# EAGLE design Sensor_Board_2.04_HX711_DS18b2 (EAGLE 9.6.2)
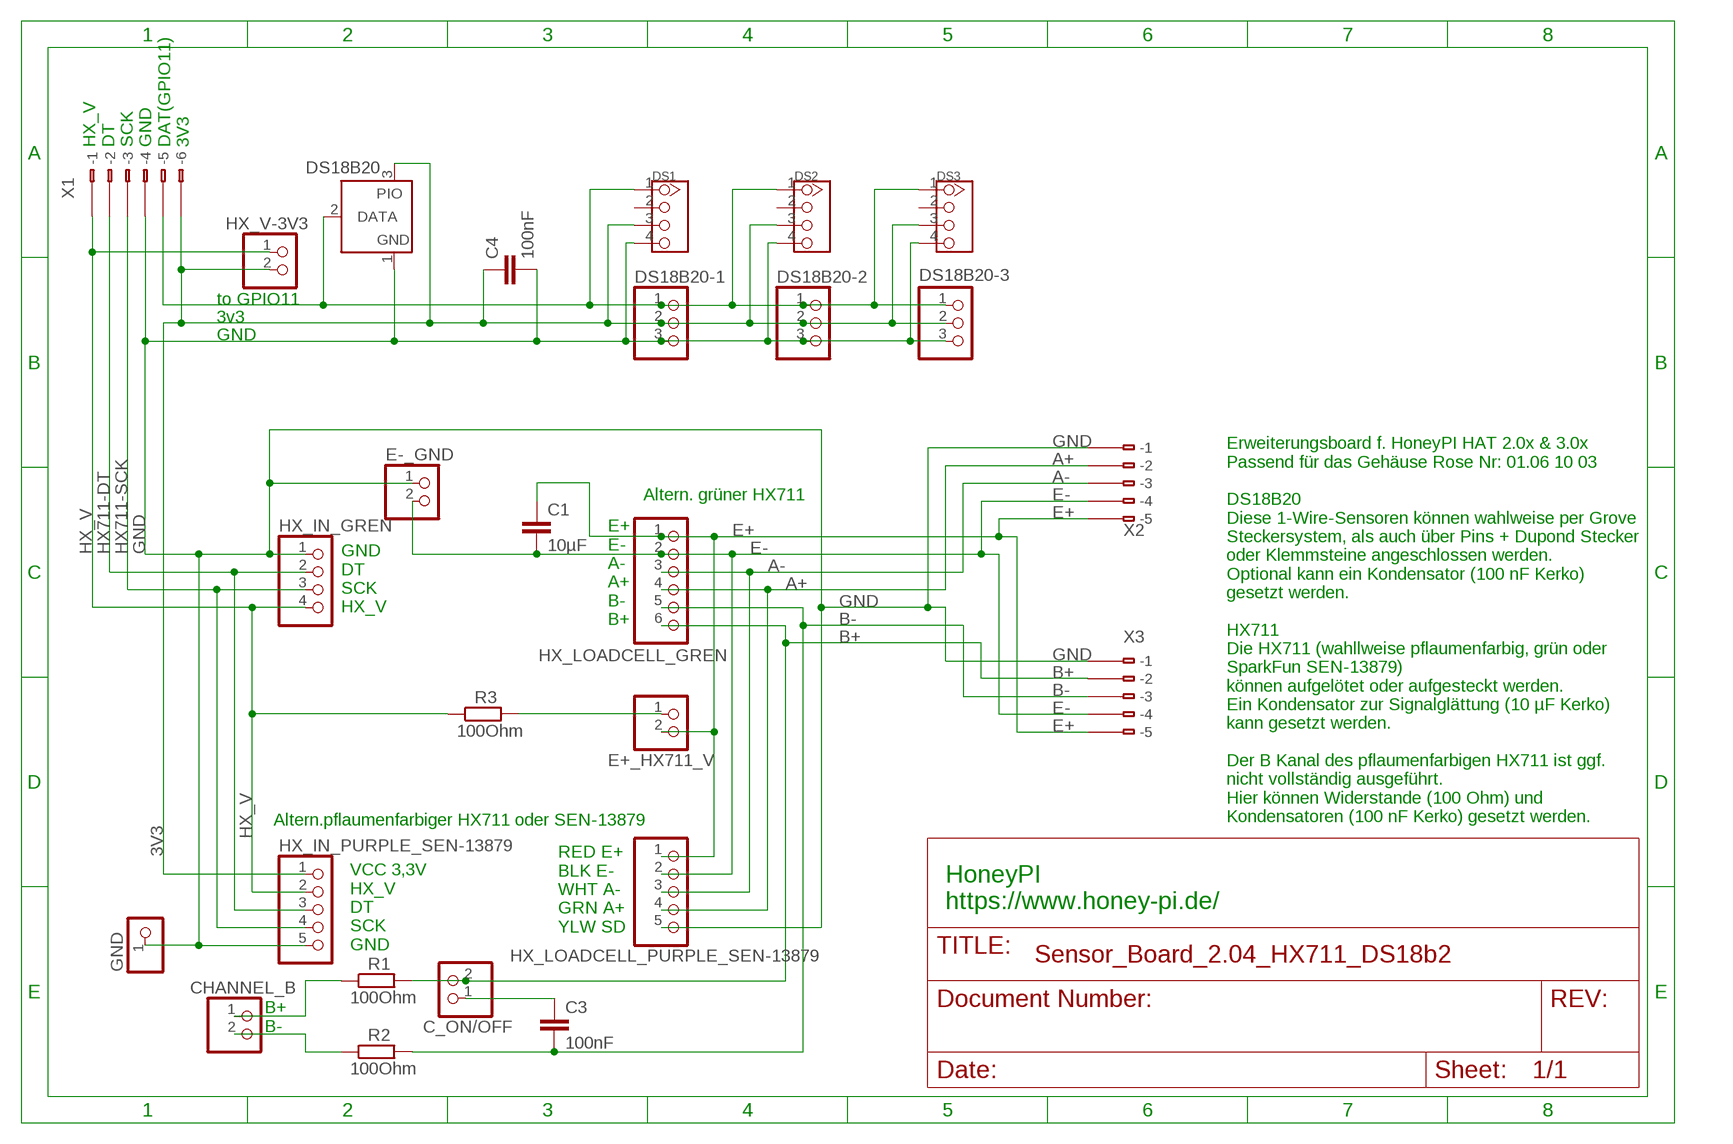
[diagram p0: schematic, sheet 1]

## Parts
C1  10µF  C5/2.5  [C5B2.5]
C3  100nF  C5/2.5  [C5B2.5]
C4  100nF  C5/2.5  [C5B2.5]
C_ON/OFF  PINHD-1X2  [1X02]
CHANNEL_B  PINHD-1X2  [1X02]
DS1  TWIG-4P-2.0-2.0  [4P-2.0]
DS2  TWIG-4P-2.0-2.0  [4P-2.0]
DS3  TWIG-4P-2.0-2.0  [4P-2.0]
DS18B20  DS2405  [TO92-]
DS18B20-1  PINHD-1X3  [1X03]
DS18B20-2  PINHD-1X3  [1X03]
DS18B20-3  PINHD-1X3  [1X03]
E+_HX711_V  PINHD-1X2  [1X02]
E-_GND  PINHD-1X2  [1X02]
GND  PINHD-1X1  [1X01]
HX_IN_GREN  PINHD-1X4  [1X04]
HX_IN_PURPLE_SEN-13879  PINHD-1X5  [1X05]
HX_LOADCELL_GREN  PINHD-1X6  [1X06]
HX_LOADCELL_PURPLE_SEN-13879  PINHD-1X5  [1X05]
HX_V-3V3  PINHD-1X2  [1X02]
R1  100Ohm  R-EU_0207/10  [0207/10]
R2  100Ohm  R-EU_0207/10  [0207/10]
R3  100Ohm  R-EU_0207/10  [0207/10]
X1  233-506  [233-506]
X2  233-505  [233-505]
X3  233-505  [233-505]

## Nets
3V3 [Supply3v3]: C4.1 DS1.3 DS2.3 DS3.3 DS18B20-1.2 DS18B20-2.2 DS18B20-3.2 DS18B20.3(PIO) HX_IN_PURPLE_SEN-13879.1 HX_V-3V3.2 X1.B6(B-6)
A+: HX_LOADCELL_GREN.4 HX_LOADCELL_PURPLE_SEN-13879.4 X2.B2(B-2)
A-: HX_LOADCELL_GREN.3 HX_LOADCELL_PURPLE_SEN-13879.3 X2.B3(B-3)
B+: C_ON/OFF.2 HX_LOADCELL_GREN.6 R1.2 X3.B2(B-2)
B-: C3.2 HX_LOADCELL_GREN.5 R2.2 X3.B3(B-3)
DS18B20_DATA_GPIO11_PIN23: DS1.1 DS2.1 DS3.1 DS18B20-1.1 DS18B20-2.1 DS18B20-3.1 DS18B20.2(DATA) X1.B5(B-5)
E+ [Supply5v]: C1.1 E+_HX711_V.2 HX_LOADCELL_GREN.1 HX_LOADCELL_PURPLE_SEN-13879.1 X2.B5(B-5) X3.B5(B-5)
E- [Supply5v]: C1.2 E-_GND.2 HX_LOADCELL_GREN.2 HX_LOADCELL_PURPLE_SEN-13879.2 X2.B4(B-4) X3.B4(B-4)
GND [Supply5v]: C4.2 DS1.4 DS2.4 DS3.4 DS18B20-1.3 DS18B20-2.3 DS18B20-3.3 DS18B20.1(GND) E-_GND.1 GND.1 HX_IN_GREN.1 HX_IN_PURPLE_SEN-13879.5 HX_LOADCELL_PURPLE_SEN-13879.5 X1.B4(B-4) X2.B1(B-1) X3.B1(B-1)
HX711-DT: HX_IN_GREN.2 HX_IN_PURPLE_SEN-13879.3 X1.B2(B-2)
HX711-SCK: HX_IN_GREN.3 HX_IN_PURPLE_SEN-13879.4 X1.B3(B-3)
HX_V [Supply5v]: HX_IN_GREN.4 HX_IN_PURPLE_SEN-13879.2 HX_V-3V3.1 R3.1 X1.B1(B-1)
N$1: CHANNEL_B.1 R1.1
N$2: CHANNEL_B.2 R2.1
N$3: C3.1 C_ON/OFF.1
N$4 [Supply5v]: E+_HX711_V.1 R3.2
Unconnected: DS1.2 DS2.2 DS3.2 X1.A1(-1) X1.A2(-2) X1.A3(-3) X1.A4(-4) X1.A5(-5) X1.A6(-6) X2.A1(-1) X2.A2(-2) X2.A3(-3) X2.A4(-4) X2.A5(-5) X3.A1(-1) X3.A2(-2) X3.A3(-3) X3.A4(-4) X3.A5(-5)

## Notes on the sheet
- HX_V
  DT
  SCK
  GND
  DAT(GPIO11)
  3V3
- to GPIO11
- 3v3
- GND
- Altern. grüner HX711
- GND
  DT
  SCK
  HX_V
- E+
  E-
  A-
  A+
  B-
  B+
- Erweiterungsboard f. HoneyPI HAT 2.0x & 3.0x
  Passend für das Gehäuse Rose Nr: 01.06 10 03 
  
  DS18B20
  Diese 1-Wire-Sensoren können wahlweise per Grove
  Steckersystem, als auch über Pins + Dupond Stecker
  oder Klemmsteine angeschlossen werden.
  Optional kann ein Kondensator (100 nF Kerko) 
  gesetzt werden. 
  
  HX711
  Die HX711 (wahllweise pflaumenfarbig, grün oder 
  SparkFun SEN-13879)
  können aufgelötet oder aufgesteckt werden.
  Ein Kondensator zur Signalglättung (10 µF Kerko)
  kann gesetzt werden.
  
  Der B Kanal des pflaumenfarbigen HX711 ist ggf. 
  nicht vollständig ausgeführt.
  Hier können Widerstande (100 Ohm) und
  Kondensatoren (100 nF Kerko) gesetzt werden.
- Altern.pflaumenfarbiger HX711 oder SEN-13879
- HoneyPI
  https://www.honey-pi.de/
- RED E+
  BLK E-
  WHT A-
  GRN A+
  YLW SD
- VCC 3,3V
  HX_V
  DT
  SCK
  GND
- B+
  B-

## Library data of the parts
C1 C3 C4 = capacitor-wima:C: CAPACITOR naming: grid - package width
C_ON/OFF CHANNEL_B E+_HX711_V E-_GND HX_V-3V3 = pinhead:PINHD-1X2: PIN HEADER
DS1-DS3 = Connector:TWIG-4P-2.0
DS18B20 = maxim:DS2405: Addressable Switch DALLAS Semiconductor; MF: DALLAS SEMICONDUCTOR; MPN: DS2405; OC_FARNELL: 1188025; OC_NEWARK: 06F4645
DS18B20-1-DS18B20-3 = pinhead:PINHD-1X3: PIN HEADER
GND = pinhead:PINHD-1X1: PIN HEADER
HX_IN_GREN = pinhead:PINHD-1X4: PIN HEADER
HX_IN_PURPLE_SEN-13879 HX_LOADCELL_PURPLE_SEN-13879 = pinhead:PINHD-1X5: PIN HEADER
HX_LOADCELL_GREN = pinhead:PINHD-1X6: PIN HEADER
R1-R3 = rcl:R-EU_: RESISTOR, European symbol; SPICEPREFIX: R
X1 = con-wago:233-506: WAGO Cage Clamp; MF: Wago Corporation; MPN: 0233-0506; OC_FARNELL: 1777100; OC_NEWARK: 79K2052
X2 X3 = con-wago:233-505: WAGO Cage Clamp; MF: Wago Corporation; MPN: 0233-0505; OC_FARNELL: unknown; OC_NEWARK: 79K2051

## Net classes
0 Signal: width 0.152 mm, clearance 0.305 mm
1 Supply3v3: width 0.203 mm, clearance 0.305 mm
2 Supply5v: width 0.406 mm, clearance 0.305 mm

## Board
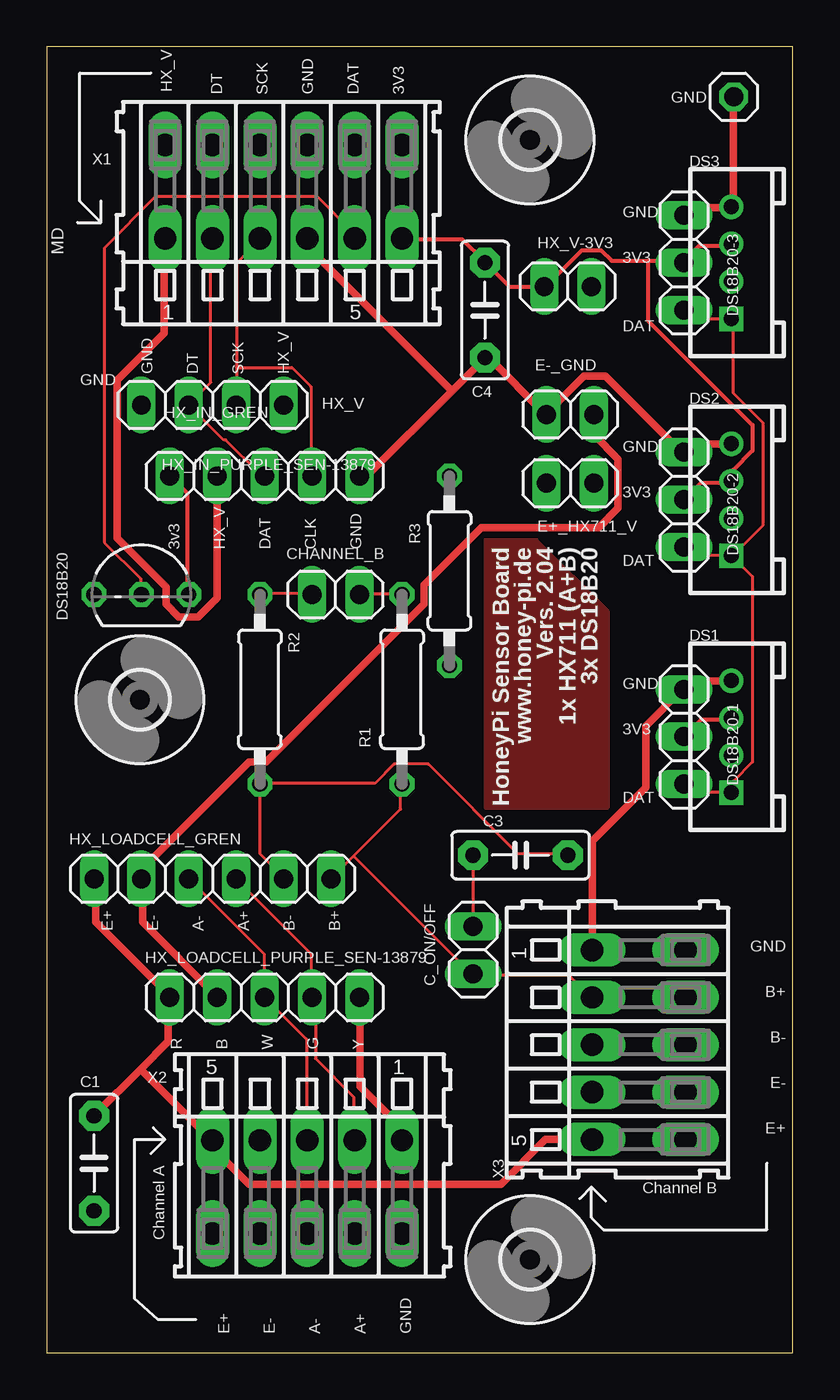
[diagram p1: board, top side]
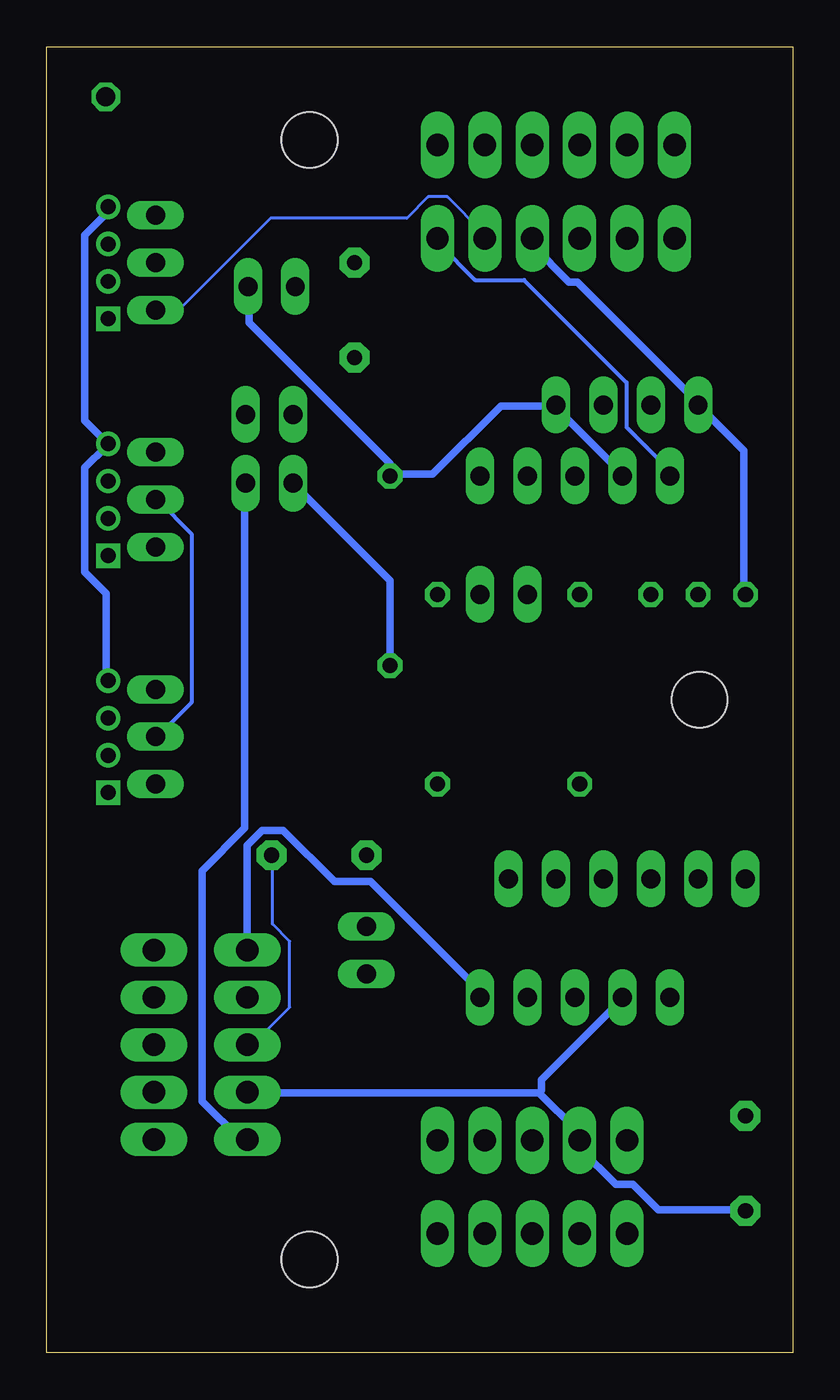
[diagram p2: board, bottom side, seen from below]

Size 40 x 70 mm. Coordinates in mm from the lower left corner, seen from the top.
Outline: 0,0 40,0 40,70 0,70 0,0
Copper layers (1*16): Top 0.035mm / dielectric 1.5mm / Bottom 0.035mm
Design rules "default *": minimum track width 6mil, minimum drill 0.35mm, track to track 6mil, track to pad 6mil, pad to pad 6mil, via to via 6mil, smd to smd 6mil, copper to edge 40mil, drill to drill 1mm, minimum pad ring 10mil, minimum via ring 8mil, stop-mask expansion 4mil, vias tented up to drill 0mil, thermal gap 10mil

### Footprints (pad centres in the part's own frame; a part is rotated, then mirrored left to right if it is on the bottom)
C5B2.5 = drill 0.813 pad 1.6 octagon: 1 -2.54,0; 2 2.54,0
1X02 = drill 1.016 long: 1 -1.27,0; 2 1.27,0
4P-2.0 = drill 0.8 pad 1.27 square: 1 -3,0 | drill 0.8 pad 1.27: 2 -1,0; 3 1,0; 4 3,0
TO92- = drill 0.813 octagon: 1 -2.54,0; 2 0,0; 3 2.54,0
1X03 = drill 1.016 long: 1 -2.54,0; 2 0,0; 3 2.54,0
1X01 = drill 1.016 octagon: 1 0,0
1X04 = drill 1.016 long: 1 -3.81,0; 2 -1.27,0; 3 1.27,0; 4 3.81,0
1X05 = drill 1.016 long: 1 -5.08,0; 2 -2.54,0; 3 0,0; 4 2.54,0; 5 5.08,0
1X06 = drill 1.016 long: 1 -6.35,0; 2 -3.81,0; 3 -1.27,0; 4 1.27,0; 5 3.81,0; 6 6.35,0
0207/10 = drill 0.813 octagon: 1 -5.08,0; 2 5.08,0
3,0 = hole 3: 0,0
233-506 = drill 1.2 long: A1 -6.35,2.5; A2 -3.81,2.5; A3 -1.27,2.5; A4 1.27,2.5; A5 3.81,2.5; A6 6.35,2.5; B1 -6.35,-2.5; B2 -3.81,-2.5; B3 -1.27,-2.5; B4 1.27,-2.5; B5 3.81,-2.5; B6 6.35,-2.5
233-505 = drill 1.2 long: A1 -5.08,2.5; A2 -2.54,2.5; A3 0,2.5; A4 2.54,2.5; A5 5.08,2.5; B1 -5.08,-2.5; B2 -2.54,-2.5; B3 0,-2.5; B4 2.54,-2.5; B5 5.08,-2.5

### Placement (x,y rotation side)
C1  2.54,10.16 270 top
C3  25.4,26.67 0 top
C4  23.5,55.88 270 top
C_ON/OFF  22.86,21.59 270 top
CHANNEL_B  15.49,40.64 180 top
DS1  36.7,33.02 90 top
DS2  36.7,45.72 90 top
DS3  36.7,58.42 90 top
DS18B20  5.08,40.64 0 top
DS18B20-1  34.16,33.02 90 top
DS18B20-2  34.16,45.72 90 top
DS18B20-3  34.16,58.42 90 top
E+_HX711_V  28.07,46.61 0 top
E-_GND  28.07,50.29 0 top
GND  36.83,67.31 0 top
HX_IN_GREN  8.89,50.8 0 top
HX_IN_PURPLE_SEN-13879  11.68,46.99 0 top
HX_LOADCELL_GREN  8.89,25.4 0 top
HX_LOADCELL_PURPLE_SEN-13879  11.68,19.05 0 top
HX_V-3V3  27.94,57.15 180 top
R1  19.05,35.56 270 top
R2  11.43,35.56 270 top
R3  21.59,41.91 270 top
U$1  [3,0]  25.91,5 0 top
U$2  [3,0]  25.91,65 0 top
U$5  [3,0]  5,35 0 top
X1  12.7,62.23 0 top
X2  13.97,8.89 180 top
X3  31.75,16.51 270 top

### Tracks (layer width: path | path; a pad name or v marks a point on that pad's centre or on a via)
3V3
  Top 0.203: DS18B20-1.2 35.09,33.95 36.69,33.95 DS1.3 | DS18B20-2.2 34.18,45.72 35.09,46.63 36.69,46.63 DS2.3 36.8,46.75 36.8,47.32 37.83,48.35 37.83,49.72 32.23,55.32 32.23,58.52 | DS18B20.3 7.54,40.69 7.54,46.06 6.63,46.98 HX_IN_PURPLE_SEN-13879.1 | DS3.3 36.69,59.32 34.98,59.32 34.18,58.52 DS18B20-3.2 34.06,58.52 32.23,58.52 | X1.B6 19.09,59.66 22.29,59.66 23.43,58.52 C4.1 23.55,58.41 24.8,57.15 HX_V-3V3.2 26.75,57.15 28.69,59.09 29.72,59.09 30.29,58.52 32.23,58.52
  Bottom 0.203: DS18B20-1.2 34.06,33.03 32.23,34.86 32.23,43.89 34.06,45.72 DS18B20-2.2 | HX_IN_PURPLE_SEN-13879.1 6.63,47.09 6.63,47.32 8.91,49.61 8.91,52.01 14.4,57.49 17.03,57.49 18.97,59.44 18.97,59.66 X1.B6
A+
  Top 0.152: HX_LOADCELL_GREN.4 10.17,25.38 14.17,21.37 14.17,19.09 HX_LOADCELL_PURPLE_SEN-13879.4 14.29,18.97 14.4,18.86 14.4,15.77 16.46,13.72 16.46,11.43 X2.B2
A-
  Top 0.152: HX_LOADCELL_GREN.3 7.66,25.38 11.66,21.37 11.66,19.09 HX_LOADCELL_PURPLE_SEN-13879.3 11.77,18.97 13.95,16.8 13.95,11.43 X2.B3
B+
  Top 0.152: 16.46,26.63 15.32,25.49 HX_LOADCELL_GREN.6 | 16.46,26.63 18.97,29.15 18.97,30.4 R1.2 | 22.86,20.23 28,20.23 29.15,19.09 X3.B2 | 22.86,20.23 16.46,26.63 | 22.86,20.23 C_ON/OFF.2
B-
  Top 0.152: HX_LOADCELL_GREN.5 12.69,25.49 11.43,26.75 R2.2 11.43,30.52 17.6,30.52 18.63,31.55 20.46,31.55 25.26,26.75 27.89,26.75 C3.2
  Bottom 0.152: C3.2 27.89,26.63 27.89,22.97 26.98,22.06 26.98,18.52 28.92,16.57 29.15,16.57 X3.B3
DS18B20_DATA_GPIO11_PIN23
  Top 0.152: DS18B20-3.1 34.18,55.78 34.52,55.44 36.69,55.44 DS3.1 36.8,55.32 36.8,51.44 38.41,49.84 38.41,44.35 36.8,42.75 DS2.1 | DS18B20-1.1 34.18,30.4 34.52,30.06 36.69,30.06 DS1.1 36.8,30.06 36.8,30.63 37.83,31.66 37.83,41.6 36.8,42.63 DS2.1 | DS2.1 36.69,42.75 34.52,42.75 34.18,43.09 DS18B20-2.1 | DS18B20.2 5.03,40.69 5.03,41.49 3.09,43.43 3.09,59.21 5.83,61.95 14.52,61.95 16.46,60.01 16.46,59.78 X1.B5
  Bottom 0.152: DS18B20-3.1 34.06,55.89 32.92,55.89 28,60.81 20.69,60.81 19.55,61.95 18.52,61.95 16.57,60.01 16.57,59.78 X1.B5
E+
  Top 0.406: 5.03,15.2 2.63,12.8 C1.1 | 5.03,15.2 6.51,16.69 6.51,18.97 HX_LOADCELL_PURPLE_SEN-13879.1 6.51,19.2 2.63,23.09 2.63,25.38 HX_LOADCELL_GREN.1 | 5.03,15.2 8.8,11.43 X2.B5 8.91,11.2 8.91,10.97 10.86,9.03 24.35,9.03 26.75,11.43 X3.B5
  Bottom 0.406: X3.B5 29.6,11.43 31.66,13.49 31.66,25.83 29.38,28.12 29.38,46.52 E+_HX711_V.2
E-
  Top 0.406: HX_LOADCELL_PURPLE_SEN-13879.2 9.14,19.09 5.14,23.09 5.14,25.38 HX_LOADCELL_GREN.2 5.26,25.49 5.26,26.06 10.86,31.66 11.77,31.66 20.23,40.12 20.23,41.15 23.32,44.23 29.6,44.23 30.63,45.26 30.63,47.89 29.38,49.15 29.38,50.29 E-_GND.2
  Bottom 0.406: C1.2 2.63,7.66 7.2,7.66 8.57,9.03 9.49,9.03 11.43,10.97 X2.B4 11.54,11.54 11.54,11.89 13.6,13.95 | 13.6,13.95 29.15,13.95 X3.B4 | 13.6,13.95 13.49,14.06 13.49,14.63 9.14,18.97 HX_LOADCELL_PURPLE_SEN-13879.2
GND
  Top 0.406: HX_LOADCELL_PURPLE_SEN-13879.5 16.8,18.97 16.8,14.29 18.97,12.12 18.97,11.43 X2.B1 | DS1.4 36.69,36.01 34.52,36.01 34.18,35.66 DS18B20-1.3 34.06,35.55 32.12,33.6 32.12,30.29 29.26,27.43 29.26,21.6 X3.B1 | DS18B20-3.3 34.18,61.04 34.52,61.38 36.69,61.38 DS3.4 36.8,61.49 36.8,67.21 GND.1 | DS2.4 36.69,48.69 34.52,48.69 34.18,48.35 DS18B20-2.3 34.06,48.46 33.83,48.46 29.95,52.35 28.8,52.35 26.86,50.41 E-_GND.1 26.75,50.29 23.66,53.38 C4.2 23.43,53.26 21.72,51.55 | 21.72,51.55 17.26,47.09 16.8,47.09 HX_IN_PURPLE_SEN-13879.5 | 21.72,51.55 14.06,59.21 14.06,59.66 X1.B4
  Bottom 0.406: HX_LOADCELL_PURPLE_SEN-13879.5 16.8,19.09 16.8,19.43 22.63,25.26 24.57,25.26 27.32,28 28.46,28 29.26,27.2 29.26,21.6 X3.B1 | DS18B20.1 2.63,40.69 2.63,48.35 HX_IN_GREN.1 5.14,50.98 11.54,57.38 12,57.38 13.95,59.32 13.95,59.66 X1.B4 | DS3.4 36.8,61.38 36.8,61.04 37.95,59.89 37.95,49.95 36.8,48.81 DS2.4 36.8,48.58 37.95,47.43 37.95,41.83 36.8,40.69 36.8,36.12 DS1.4
HX711-DT
  Top 0.152: HX_IN_PURPLE_SEN-13879.3 11.66,47.09 11.43,47.09 9.6,48.92 9.49,48.92 7.66,50.75 HX_IN_GREN.2 7.66,50.86 8.8,52.01 8.8,59.66 X1.B2
HX711-SCK
  Top 0.152: 10.17,52.81 10.17,58.41 11.43,59.66 X1.B3 | 10.17,52.81 10.17,50.86 HX_IN_GREN.3 | 10.17,52.81 13.14,52.81 14.17,51.78 14.17,47.09 HX_IN_PURPLE_SEN-13879.4
HX_V
  Top 0.406: HX_IN_PURPLE_SEN-13879.2 9.14,40.46 8.12,39.43 7.09,39.43 6.4,40.12 6.4,41.03 3.77,43.66 3.77,52.12 6.29,54.63 6.29,59.66 X1.B1
  Bottom 0.406: HX_IN_PURPLE_SEN-13879.2 9.14,47.09 12.69,50.63 HX_IN_GREN.4 12.8,50.75 15.66,50.75 19.32,47.09 21.49,47.09 R3.1 21.6,47.21 21.6,47.66 29.15,55.21 29.15,57.15 HX_V-3V3.1
N$1
  Top 0.152: R1.1 18.97,40.69 16.8,40.69 CHANNEL_B.1
N$2
  Top 0.152: R2.1 11.43,40.69 14.17,40.69 CHANNEL_B.2
N$3
  Top 0.152: C3.1 C_ON/OFF.1
N$4
  Bottom 0.406: R3.2 21.6,36.92 21.6,41.38 26.75,46.52 E+_HX711_V.1
N$5
  pour Top: 23.5,43.56 23.5,29.21 30.1,29.21 30.1,39.75 26.29,43.56

### Text on the board
tNames: HX_V | DT / / SCK / / GND / / DAT / / 3V3 | MD | GND / / 3V3 / / / DAT | GND / / DT / / SCK / / HX_V | GND | HX_V | 3v3 / / HX_V / / DAT / / CLK / / GND | HoneyPi Sensor Board / www.honey-pi.de / Vers. 2.04 / 1x HX711 (A+B) / 3x DS18B20 | GND / / 3V3 / / / DAT | GND / / 3V3 / / / DAT | E+ / / E- / / A- / / A+ / / B- / / B+ | GND / / B+ / / B- / / E- / / E+ | R / / B / / W / / G / / Y | Channel A | Channel B | E+ / / E- / / A- / / A+ / / GND